# Altium schematic sheet MCU.SchDoc
size A3
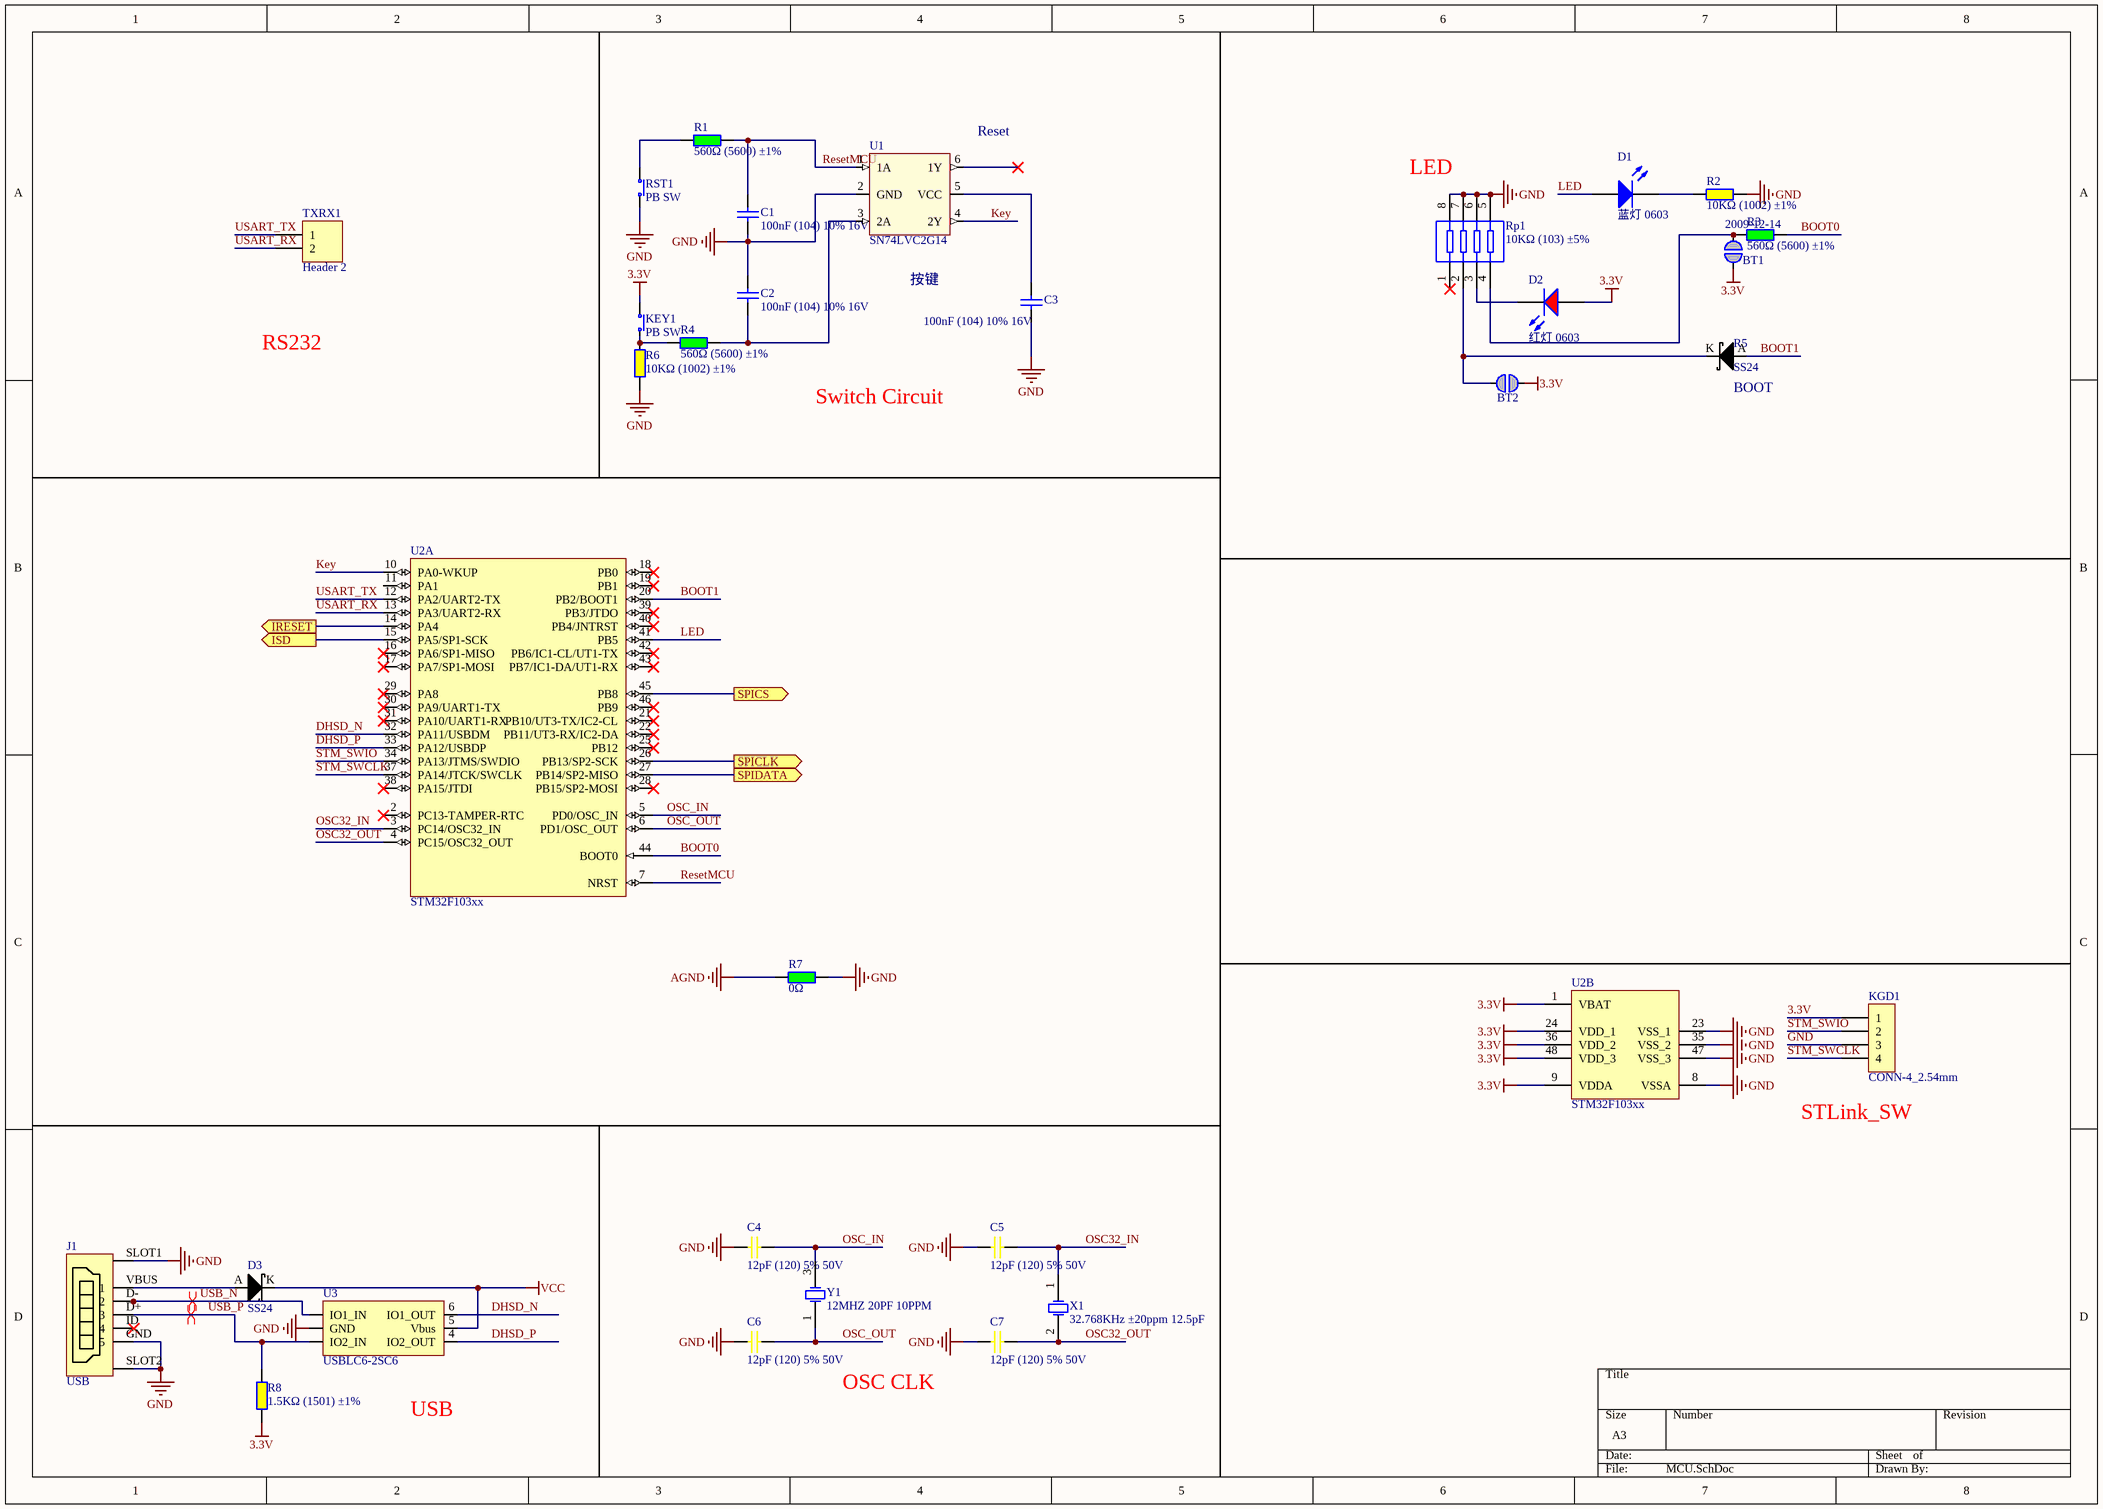
[diagram p0: MCU.SchDoc]

## Parts
BT1  LatestRevisionDate: 2009-12-14  [Solderbridge]  (hidden comment: Solderbridge)  (no BOM)
BT2  Solderbridge  [Solderbridge]  (value not drawn)  (no BOM)
C1  100nF (104) 10% 16V  [0402_C]
C2  100nF (104) 10% 16V  [0402_C]
C3  100nF (104) 10% 16V  [0402_C]
C4  12pF (120) 5% 50V  [0402_C]
C5  12pF (120) 5% 50V  [0402_C]
C6  12pF (120) 5% 50V  [0402_C]
C7  12pF (120) 5% 50V  [0402_C]
D1  蓝灯 0603  [0603_LED_S1]
D2  红灯 0603  [0603_LED_S1]
D3  SS24  [SMB-DIODE-DO214AA]
J1  USB  [MicroUSB_SMT]
KEY1  PB SW  [ALPS_SKHUxxx010_WO_GND]
KGD1  CONN-4_2.54mm  [CON4-2.54mm]
R1  560Ω (5600) ±1%  [0603_R]
R2  10KΩ (1002) ±1%  [0402_R]
R3  560Ω (5600) ±1%  [0603_R]
R4  560Ω (5600) ±1%  [0603_R]
R5  SS24  [SMB-DIODE-DO214AA]
R6  10KΩ (1002) ±1%  [0402_R]
R7  0Ω  [0603_R]
R8  1.5KΩ (1501) ±1%  [0402_R]
Rp1  10KΩ (103) ±5%  [0603_Rx4]
RST1  PB SW  [ALPS_SKHUxxx010_WO_GND]
TXRX1  Header 2  [HDR1X2]
U1  SN74LVC2G14  [SN74LVC2G14DBVR]
U2  STM32F103xx  [LQFP-48_7x7x05P]  (parts A,B of 2)
U3  USBLC6-2SC6  [SOT-23-6]
X1  32.768KHz ±20ppm 12.5pF  [SMD-3215_2P FC - 135]
Y1  12MHZ 20PF 10PPM  [SMD-3225_4P]

## Ports
IRESET (out), ISD (out), SPICLK (out), SPICS (out), SPIDATA (out)

## Nets
3.3V: BT1.2 BT2.1 D2.A KEY1.2(COM) KGD1.1 R8.1 U2.1(VBAT) U2.9(VDDA) U2.24(VDD_1) U2.36(VDD_2) U2.48(VDD_3)
AGND: R7.1
GND: C1.1 C2.2 C3.1 C4.1 C5.1 C6.1 C7.1 J1.GND(5) J1.SLOT1 J1.SLOT2 KGD1.3 R2.2 R6.1 R7.2 Rp1.5 Rp1.6 Rp1.7 Rp1.8 RST1.1(N.O) U1.2(GND) U2.8(VSSA) U2.23(VSS_1) U2.35(VSS_2) U2.47(VSS_3) U3.2(GND)
VCC: D3.K U3.5(Vbus)
BOOT0: R3.2 U2.44(BOOT0)
BOOT1: R5.A U2.20(PB2/BOOT1)
DHSD_N: U2.32(PA11/USBDM) U3.6(IO1_OUT)
DHSD_P: U2.33(PA12/USBDP) U3.4(IO2_OUT)
IRESET: U2.14(PA4) ; port IRESET
ISD: U2.15(PA5/SP1-SCK) ; port ISD
Key: U1.4(2Y) U2.10(PA0-WKUP)
LED: D1.A U2.41(PB5)
OSC32_IN: C5.2 U2.3(PC14/OSC32_IN) X1.1(OSC1)
OSC32_OUT: C7.2 U2.4(PC15/OSC32_OUT) X1.2(OSC2)
OSC_IN: C4.2 U2.5(PD0/OSC_IN) Y1.3(OSC2)
OSC_OUT: C6.2 U2.6(PD1/OSC_OUT) Y1.1(OSC1)
ResetMCU: C1.2 R1.2 U1.1(1A) U2.7(NRST)
SPICLK: U2.26(PB13/SP2-SCK) ; port SPICLK
SPICS: U2.45(PB8) ; port SPICS
SPIDATA: U2.27(PB14/SP2-MISO) ; port SPIDATA
STM_SWCLK: KGD1.4 U2.37(PA14/JTCK/SWCLK)
STM_SWIO: KGD1.2 U2.34(PA13/JTMS/SWDIO)
USART_RX: TXRX1.2 U2.13(PA3/UART2-RX)
USART_TX: TXRX1.1 U2.12(PA2/UART2-TX)
USB_N: J1.D-(2) U3.1(IO1_IN)
USB_P: J1.D+(3) R8.2 U3.3(IO2_IN)
NetBT1_1: BT1.1 R3.1 Rp1.4
NetBT2_2: BT2.2 R5.K Rp1.2
NetC2_1: C2.1 R4.2 U1.3(2A)
NetC3_2: C3.2 U1.5(VCC)
NetD1_K: D1.K R2.1
NetD2_K: D2.K Rp1.3
NetD3_A: D3.A J1.VBUS(1)
NetKEY1_1: KEY1.1(N.O) R4.1 R6.2
NetR1_1: R1.1 RST1.2(COM)

Not connected (* = marked no-connect by the designer): J1 ID(4)*; Rp1 1*; U1 6(1Y)*; U2 2(PC13-TAMPER-RTC)* 11(PA1) 16(PA6/SP1-MISO)* 17(PA7/SP1-MOSI)* 18(PB0)* 19(PB1)* 21(PB10/UT3-TX/IC2-CL)* 22(PB11/UT3-RX/IC2-DA)* 25(PB12)* 28(PB15/SP2-MOSI)* 29(PA8)* 30(PA9/UART1-TX)* 31(PA10/UART1-RX)* 38(PA15/JTDI)* 39(PB3/JTDO)* 40(PB4/JNTRST)* 42(PB6/IC1-CL/UT1-TX)* 43(PB7/IC1-DA/UT1-RX)* 46(PB9)*

## Layout directives
differential pair: USB_N, USB_P

## Notes on the sheet
- (near U1) Reset
- (near Rp1) LED
- (near U1) 按键
- RS232
- Switch Circuit
- (near R5) BOOT
- (near KGD1) STLink_SW
- OSC CLK
- USB

## Library data of the parts
BT2 = SOLDERBRIDGE: Artikkelnr Noca: N.A.; Part Number: Solderbridge; LatestRevisionDate: 2009-12-14; Pin Count: 2; Publisher: Nordic Semiconductor; Published: 2009-12-14; Value: Solderbridge
C1-C3 = 0402 100nF (104) 10% 16V: 贴片电容; ComponentLink1Description: 供应商链接; ComponentLink1URL: http://www.szlcsc.com/product/details_1877.html; Package: 0402; Supplier: LC; SuppliersPartNumber: C1525
C4-C7 = 0402 12pF (120) 5% 50V: 贴片电容; ComponentLink1Description: 供应商链接; ComponentLink1URL: http://www.szlcsc.com/product/details_1899.html; Package: 0402; Supplier: LC; SuppliersPartNumber: C1547
D1 = 0603 蓝灯: 发光二极管; Supplier: LC; SuppliersPartNumber: C72041; Package: 0603; ComponentLink1URL: http://www.szlcsc.com/product/details_73150.html; ComponentLink1Description: 供应商链接
D2 = 0603 红灯: 发光二极管; Supplier: LC; SuppliersPartNumber: C2286; Package: 0603; ComponentLink1URL: http://www.szlcsc.com/product/details_2659.html; ComponentLink1Description: 供应商链接
D3 R5 = SS24: SCHOTTKY DIODE; Manufacturer: Fairchild Semiconductor; Note: 40V 2A DO214AA; Manufacturer No: SS24; Supplier: LC; PartType: SM; ROHS: True; Pin Count: 2; SuppliersPartNumber: C64881; ComponentLink1URL: https://item.szlcsc.com/65951.html
J1 = USB: Micro-USB Type:B; Manufacturer: 精拓金; Manufacturer No: micro 5P全贴有柱无导位 平口外焊; Supplier: LC; SuppliersPartNumber: C77238; Pin Count: 6; ComponentLink1URL: https://item.szlcsc.com/78366.html
KEY1 RST1 = SW-PB_mouser: Switch; Manufacturer: 韩国韩荣; Manufacturer Part Number: K2-6639SP-C4SC-04; Note: 6.5x6.2x2.5mm; Pin Count: 4; Supplier: LC; SuppliersPartNumber: C83206; Package: SM; Value: PB SW; ComponentLink1URL: https://item.szlcsc.com/84370.html
KGD1 = CONN-4_2.54mm: 2.54mm 4pin through hole; ComponentLink1URL: https://item.szlcsc.com/125653.html; SuppliersPartNumber: C124378
R1 R3 R4 = 0603 560Ω (5600) 1%: 贴片电阻; ComponentLink1Description: 供应商链接; ComponentLink1URL: http://www.szlcsc.com/product/details_23931.html; Package: 0603; Supplier: LC; SuppliersPartNumber: C23204
R2 R6 = 0402 10KΩ (1002) 1%: 贴片电阻; ComponentLink1Description: 供应商链接; ComponentLink1URL: http://www.szlcsc.com/product/details_26487.html; Package: 0402; Supplier: LC; SuppliersPartNumber: C25744
R7 = 0603 0Ω: 贴片电阻; ComponentLink1Description: 供应商链接; ComponentLink1URL: https://item.szlcsc.com/424873.html; Package: 0603; Supplier: LC; SuppliersPartNumber: C429617
R8 = 0402 1.5KΩ (1501) 1%: 贴片电阻; ComponentLink1Description: 供应商链接; ComponentLink1URL: http://www.szlcsc.com/product/details_26610.html; Package: 0402; Supplier: LC; SuppliersPartNumber: C25867
Rp1 = 0603*4  10KΩ (103) 5%: 贴片排阻; ComponentLink1Description: 供应商链接; ComponentLink1URL: http://www.szlcsc.com/product/details_30472.html; Package: 0603*4; Supplier: LC; SuppliersPartNumber: C29718
TXRX1 = Header 2: Header, 2-Pin; LatestRevisionDate: 17-Jul-2002; LatestRevisionNote: Re-released for DXP Platform.; Publisher: Altium Limited
U1 = SN74LVC2G14: 74系列逻辑芯片; Manufacturer: TI; Note: Dual Schmitt-Trigger Inverter, 1.65V-6.5V 4.6ns,; Manufacturer No: SN74LVC2G14DBVR; Pins: 6; SuppliersPartNumber: C12401; Supplier: LC; ComponentLink1URL: https://item.szlcsc.com/13032.html
U2 = STM32F103xx: ARM; ComponentLink1Description: 供应商链接; ComponentLink1URL: http://www.szlcsc.com/product/details_9243.html; Package: LQFP-48_7x7x05P; Supplier: LC; SuppliersPartNumber: C8734
U3 = USBLC6-2SC6: ESD二极管（静电保护）; Manufacturer: ST; Supplier: LC; SuppliersPartNumber: C7519; Manufacturer No: USBLC6-2SC6; Package: SOT-23-6; ComponentLink1URL: https://item.szlcsc.com/7996.html
X1 = SMD-3215_2P 32.768KHz 20ppm 12.5pF: 贴片晶振; Supplier: LC; SuppliersPartNumber: C32346; ComponentLink1URL: http://www.szlcsc.com/product/details_33310.html; ComponentLink1Description: 供应商链接; Package: SMD-3215_2P
Y1 = SMD-3225_4P  12MHZ 20PF 10PPM: 贴片晶振; Package: SMD-3225_4P; SuppliersPartNumber: C9002; Supplier: LC; ComponentLink1URL: http://www.szlcsc.com/product/details_9522.html; ComponentLink1Description: 供应商链接
BT1 = SOLDERBRIDGE: Part Number: Solderbridge; Pin Count: 2; Publisher: Nordic Semiconductor; Published: 2009-12-14; Value: Solderbridge